# EAGLE schematic mcp2221 (EAGLE 6.4)
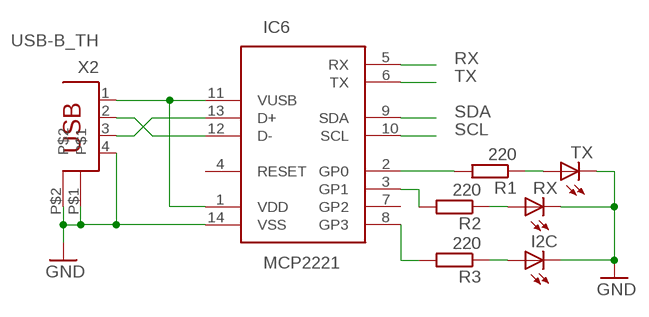
[diagram p0: schematic, sheet 1]

## Parts
I2C  LED5MM  [LED5MM]
IC6  MCP2221  [DIL14]
R1  220  R-EU_0207/10  [0207/10]
R2  220  R-EU_0207/10  [0207/10]
R3  220  R-EU_0207/10  [0207/10]
RX  LED5MM  [LED5MM]
TX  LED5MM  [LED5MM]
X2  USB-B_TH  PN61729  [PN61729]

## Nets
GND: I2C.K(C) IC6.14(VSS) RX.K(C) TX.K(C) X2.4 X2.P$1 X2.P$2
LED_RX: IC6.2(GP0) R1.2
LED_TX: IC6.3(GP1) R2.2
N$1: R1.1 TX.A
N$2: R2.1 RX.A
N$3: I2C.A R3.1
N$5: IC6.8(GP3) R3.2
N$10: IC6.12(D-) X2.2
N$27: IC6.13(D+) X2.3
RX: IC6.5(RX)
SCL: IC6.10(SCL)
SDA: IC6.9(SDA)
TX: IC6.6(TX)
VCORE: IC6.1(VDD) IC6.11(VUSB) X2.1
Unconnected: IC6.4(RESET) IC6.7(GP2)

## Library data of the parts
I2C RX TX = led:LED: LED OSRAM: - CHIPLED LG R971, LG N971, LY N971, LG Q971, LY Q971, LO R971, LY R971 LH N974, LH R974 LS Q976, LO Q976, LY Q976 LO Q996 - Hyper CHIPLED LW Q18S LB Q993, LB Q99A, LB R99A - SideLED LS A670, LO A670, LY A670, LG A670, LP A670 LB A673, LV A673, LT A673, LW A673 LH A674 LY A675 LS A676, LA A676, LO A676, LY A676, LW A676 LS A679, LY A679, LG A679 - Hyper Micro SIDELED® LS Y876, LA Y876, LO Y876, LY Y876 LT Y87S - SmartLED LW L88C, LW L88S LB L89C, LB L89S, LG L890 LS L89K, LO L89K, LY L89K LS L896, LA L896, LO L896, LY L896 - TOPLED LS T670, LO T670, LY T670, LG T670, LP T670 LSG T670, LSP T670, LSY T670, LOP T670, LYG T670 LG T671, LOG T671, LSG T671 LB T673, LV T673, LT T673, LW T673 LH T674 LS T676, LA T676, LO T676, LY T676, LB T676, LH T676, LSB T676, LW T676 LB T67C, LV T67C, LT T67C, LS T67K, LO T67K, LY T67K, LW E67C LS E67B, LA E67B, LO E67B, LY E67B, LB E67C, LV E67C, LT E67C LW T67C LS T679, LY T679, LG T679 LS T770, LO T770, LY T770, LG T770, LP T770 LB T773, LV T773, LT T773, LW T773 LH T774 LS E675, LA E675, LY E675, LS T675 LS T776, LA T776, LO T776, LY T776, LB T776 LHGB T686 LT T68C, LB T68C - Hyper Mini TOPLED® LB M676 - Mini TOPLED Santana® LG M470 LS M47K, LO M47K, LY M47K Source: http://www.osram.convergy.de LUXEON: - LUMILED® LXK2-PW12-R00, LXK2-PW12-S00, LXK2-PW14-U00, LXK2-PW14-V00 LXK2-PM12-R00, LXK2-PM12-S00, LXK2-PM14-U00 LXK2-PE12-Q00, LXK2-PE12-R00, LXK2-PE12-S00, LXK2-PE14-T00, LXK2-PE14-U00 LXK2-PB12-K00, LXK2-PB12-L00, LXK2-PB12-M00, LXK2-PB14-N00, LXK2-PB14-P00, LXK2-PB14-Q00 LXK2-PR12-L00, LXK2-PR12-M00, LXK2-PR14-Q00, LXK2-PR14-R00 LXK2-PD12-Q00, LXK2-PD12-R00, LXK2-PD12-S00 LXK2-PH12-R00, LXK2-PH12-S00 LXK2-PL12-P00, LXK2-PL12-Q00, LXK2-PL12-R00 Source: www.luxeon.com KINGBRIGHT: KA-3528ASYC Source: www.kingbright.com
IC6 = Webmaster442:MCP2221: Dual In Line / Socket
R1-R3 = rcl:R-EU_: RESISTOR, European symbol
X2 = SmartPrj:PN61729: BERG USB connector

## Net classes
0 default: clearance 0.355 mm